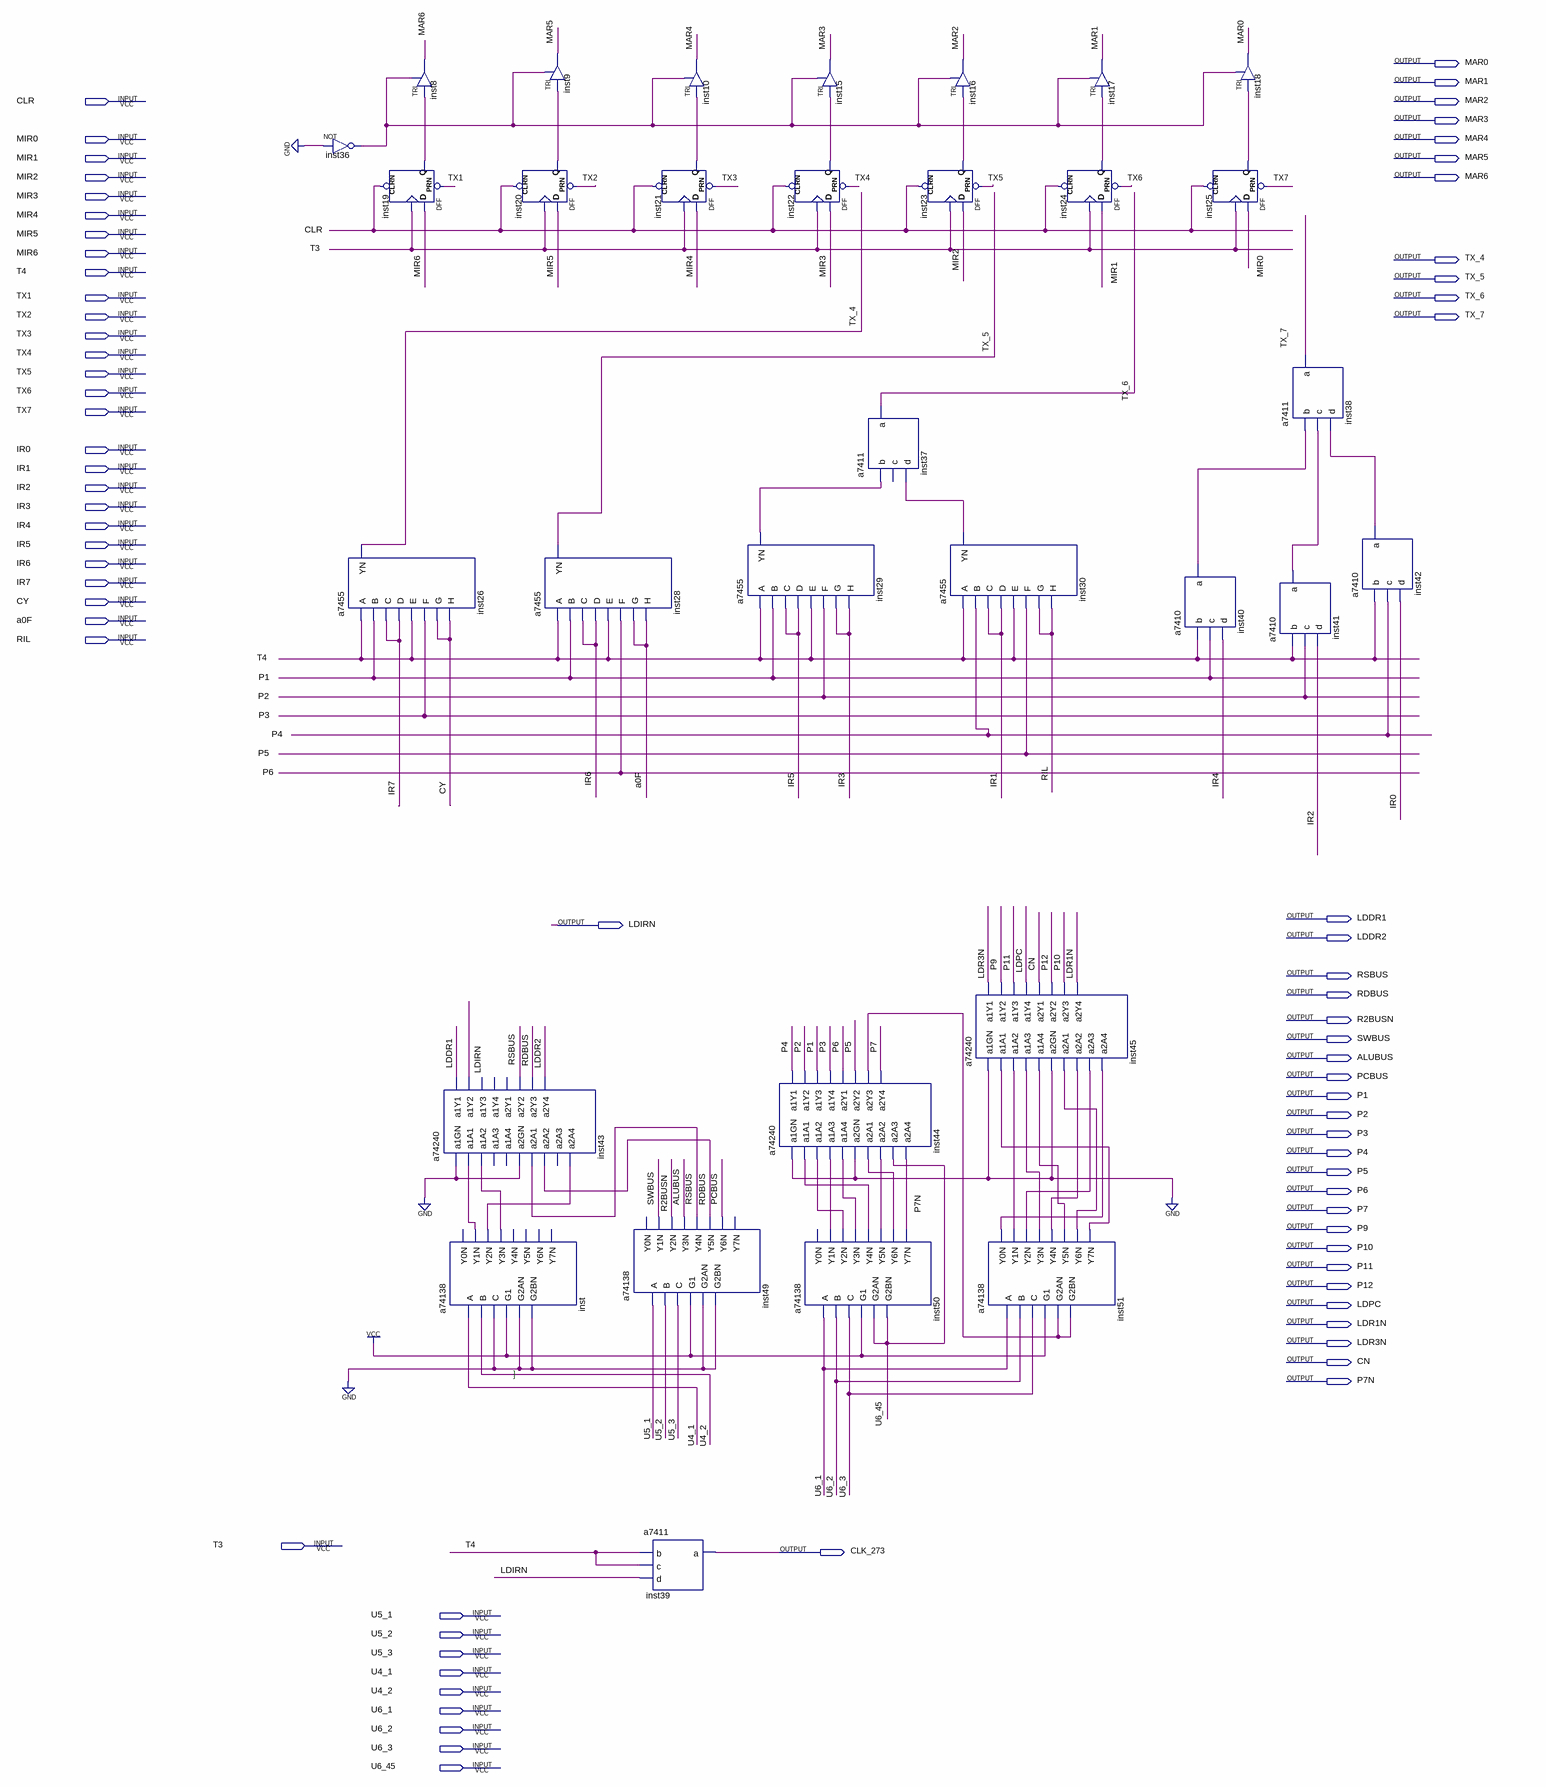
[diagram p0: schematic sheet]
// Quartus schematic G1.bdf as structural Verilog: 32 symbols, 74 pins
module G1 (
  input  CLR,
  input  MIR0,
  input  MIR1,
  input  MIR2,
  input  MIR3,
  input  MIR4,
  input  MIR5,
  input  MIR6,
  input  T4,
  input  TX1,
  input  TX2,
  input  TX3,
  input  TX4,
  input  TX5,
  input  TX6,
  input  TX7,
  input  IR0,
  input  IR1,
  input  IR2,
  input  IR3,
  input  IR4,
  input  IR5,
  input  IR6,
  input  IR7,
  input  CY,
  input  a0F,
  input  RIL,
  input  T3,
  input  U5_1,
  input  U5_2,
  input  U5_3,
  input  U4_1,
  input  U4_2,
  input  U6_1,
  input  U6_2,
  input  U6_3,
  input  U6_45,
  output MAR0,
  output MAR1,
  output MAR2,
  output MAR3,
  output MAR4,
  output MAR5,
  output MAR6,
  output TX_4,
  output TX_5,
  output TX_6,
  output TX_7,
  output LDDR1,
  output LDIRN,
  output LDDR2,
  output RSBUS,
  output RDBUS,
  output R2BUSN,
  output SWBUS,
  output ALUBUS,
  output PCBUS,
  output P1,
  output P2,
  output P3,
  output P4,
  output P5,
  output P6,
  output P7,
  output P9,
  output P10,
  output P11,
  output P12,
  output LDPC,
  output LDR1N,
  output LDR3N,
  output CN,
  output P7N,
  output CLK_273
);

  wire inst19_q, inst20_q, inst21_q, inst22_q, inst23_q, inst24_q, inst25_q, inst29_yn, inst30_yn,
       inst36_out, inst40_a, inst41_a, inst42_a, inst44_a2y3, inst50_y1n, inst50_y2n, inst50_y3n, inst50_y4n,
       inst50_y5n, inst50_y6n, inst51_y0n, inst51_y1n, inst51_y2n, inst51_y3n, inst51_y4n, inst51_y5n,
       inst51_y6n, inst51_y7n, inst_y1n, inst_y2n, inst_y3n;

  not inst36 (inst36_out, 1'b0);
  a7455 inst26 (.A(T4), .B(P1), .C(IR7), .D(IR7), .E(T4), .F(P3), .G(CY), .H(CY), .YN(TX_4));
  TRI inst8 (.IN(inst19_q), .OE(inst36_out), .OUT(MAR6));
  DFF inst19 (.CLRN(CLR), .CLK(T3), .D(MIR6), .PRN(TX1), .Q(inst19_q));
  a74240 inst43 (
    .a1GN(1'b0), .a1A1(inst_y1n), .a1A2(inst_y3n), .a2GN(1'b0), .a2A1(RSBUS), .a2A2(RDBUS), .a2A4(inst_y2n),
    .a1Y1(LDDR1), .a1Y2(LDIRN), .a2Y2(RSBUS), .a2Y3(RDBUS), .a2Y4(LDDR2));  // open: a1A3, a1A4, a2A3, a1Y3, a1Y4, a2Y1
  a74138 inst (
    .G1(1'b1), .G2AN(1'b0), .G2BN(1'b0), .A(U4_1), .B(U4_2), .C(1'b0), .Y1N(inst_y1n), .Y2N(inst_y2n),
    .Y3N(inst_y3n));  // open: Y0N, Y4N, Y5N, Y6N, Y7N
  DFF inst20 (.CLRN(CLR), .CLK(T3), .D(MIR5), .PRN(TX2), .Q(inst20_q));
  TRI inst9 (.IN(inst20_q), .OE(inst36_out), .OUT(MAR5));
  a7455 inst28 (.A(T4), .B(P1), .C(IR6), .D(IR6), .E(T4), .F(P6), .G(a0F), .H(a0F), .YN(TX_5));
  DFF inst21 (.CLRN(CLR), .CLK(T3), .D(MIR4), .PRN(TX3), .Q(inst21_q));
  a74138 inst49 (
    .G1(1'b1), .G2AN(1'b0), .G2BN(1'b0), .A(U5_1), .B(U5_2), .C(U5_3), .Y1N(SWBUS), .Y2N(R2BUSN),
    .Y3N(ALUBUS), .Y4N(RSBUS), .Y5N(RDBUS), .Y6N(PCBUS));  // open: Y0N, Y7N
  a7411 inst39 (.b(T4), .c(T4), .d(LDIRN), .a(CLK_273));
  TRI inst10 (.IN(inst21_q), .OE(inst36_out), .OUT(MAR4));
  a7455 inst29 (.A(T4), .B(P1), .C(IR5), .D(IR5), .E(T4), .F(P2), .G(IR3), .H(IR3), .YN(inst29_yn));
  a74240 inst44 (
    .a1GN(1'b0), .a1A1(inst50_y4n), .a1A2(inst50_y2n), .a1A3(inst50_y1n), .a1A4(inst50_y3n), .a2GN(1'b0),
    .a2A1(inst50_y6n), .a2A2(inst50_y5n), .a2A3(U6_45), .a2A4(P7N), .a1Y1(P4), .a1Y2(P2), .a1Y3(P1),
    .a1Y4(P3), .a2Y1(P6), .a2Y2(P5), .a2Y3(inst44_a2y3), .a2Y4(P7));
  TRI inst15 (.IN(inst22_q), .OE(inst36_out), .OUT(MAR3));
  DFF inst22 (.CLRN(CLR), .CLK(T3), .D(MIR3), .PRN(TX4), .Q(inst22_q));
  a74138 inst50 (
    .G1(1'b1), .G2AN(U6_45), .G2BN(U6_45), .A(U6_1), .B(U6_2), .C(U6_3), .Y1N(inst50_y1n), .Y2N(inst50_y2n),
    .Y3N(inst50_y3n), .Y4N(inst50_y4n), .Y5N(inst50_y5n), .Y6N(inst50_y6n), .Y7N(P7N));  // open: Y0N
  a7411 inst37 (.b(inst29_yn), .d(inst30_yn), .a(TX_6));  // open: c
  DFF inst23 (.CLRN(CLR), .CLK(T3), .D(MIR2), .PRN(TX5), .Q(inst23_q));
  TRI inst16 (.IN(inst23_q), .OE(inst36_out), .OUT(MAR2));
  a7455 inst30 (.A(T4), .B(P4), .C(IR1), .D(IR1), .E(T4), .F(P5), .G(RIL), .H(RIL), .YN(inst30_yn));
  a74240 inst45 (
    .a1GN(1'b0), .a1A1(inst51_y7n), .a1A2(inst51_y1n), .a1A3(inst51_y3n), .a1A4(inst51_y5n), .a2GN(1'b0),
    .a2A1(inst51_y6n), .a2A2(inst51_y4n), .a2A3(inst51_y2n), .a2A4(inst51_y0n), .a1Y1(LDR3N), .a1Y2(P9),
    .a1Y3(P11), .a1Y4(LDPC), .a2Y1(CN), .a2Y2(P12), .a2Y3(P10), .a2Y4(LDR1N));
  a74138 inst51 (
    .G1(1'b1), .G2AN(inst44_a2y3), .G2BN(inst44_a2y3), .A(U6_1), .B(U6_2), .C(U6_3), .Y0N(inst51_y0n),
    .Y1N(inst51_y1n), .Y2N(inst51_y2n), .Y3N(inst51_y3n), .Y4N(inst51_y4n), .Y5N(inst51_y5n),
    .Y6N(inst51_y6n), .Y7N(inst51_y7n));
  DFF inst24 (.CLRN(CLR), .CLK(T3), .D(MIR1), .PRN(TX6), .Q(inst24_q));
  TRI inst17 (.IN(inst24_q), .OE(inst36_out), .OUT(MAR1));
  a7410 inst40 (.b(T4), .c(P1), .d(IR4), .a(inst40_a));
  DFF inst25 (.CLRN(CLR), .CLK(T3), .D(MIR0), .PRN(TX7), .Q(inst25_q));
  TRI inst18 (.IN(inst25_q), .OE(inst36_out), .OUT(MAR0));
  a7410 inst41 (.b(T4), .c(P2), .d(IR2), .a(inst41_a));
  a7411 inst38 (.b(inst40_a), .c(inst41_a), .d(inst42_a), .a(TX_7));
  a7410 inst42 (.b(T4), .c(P4), .d(IR0), .a(inst42_a));

  // Notes on the sheet:
  //   ]
endmodule
